# EAGLE schematic WSN_Gateway_v3 (EAGLE 8.2.2)
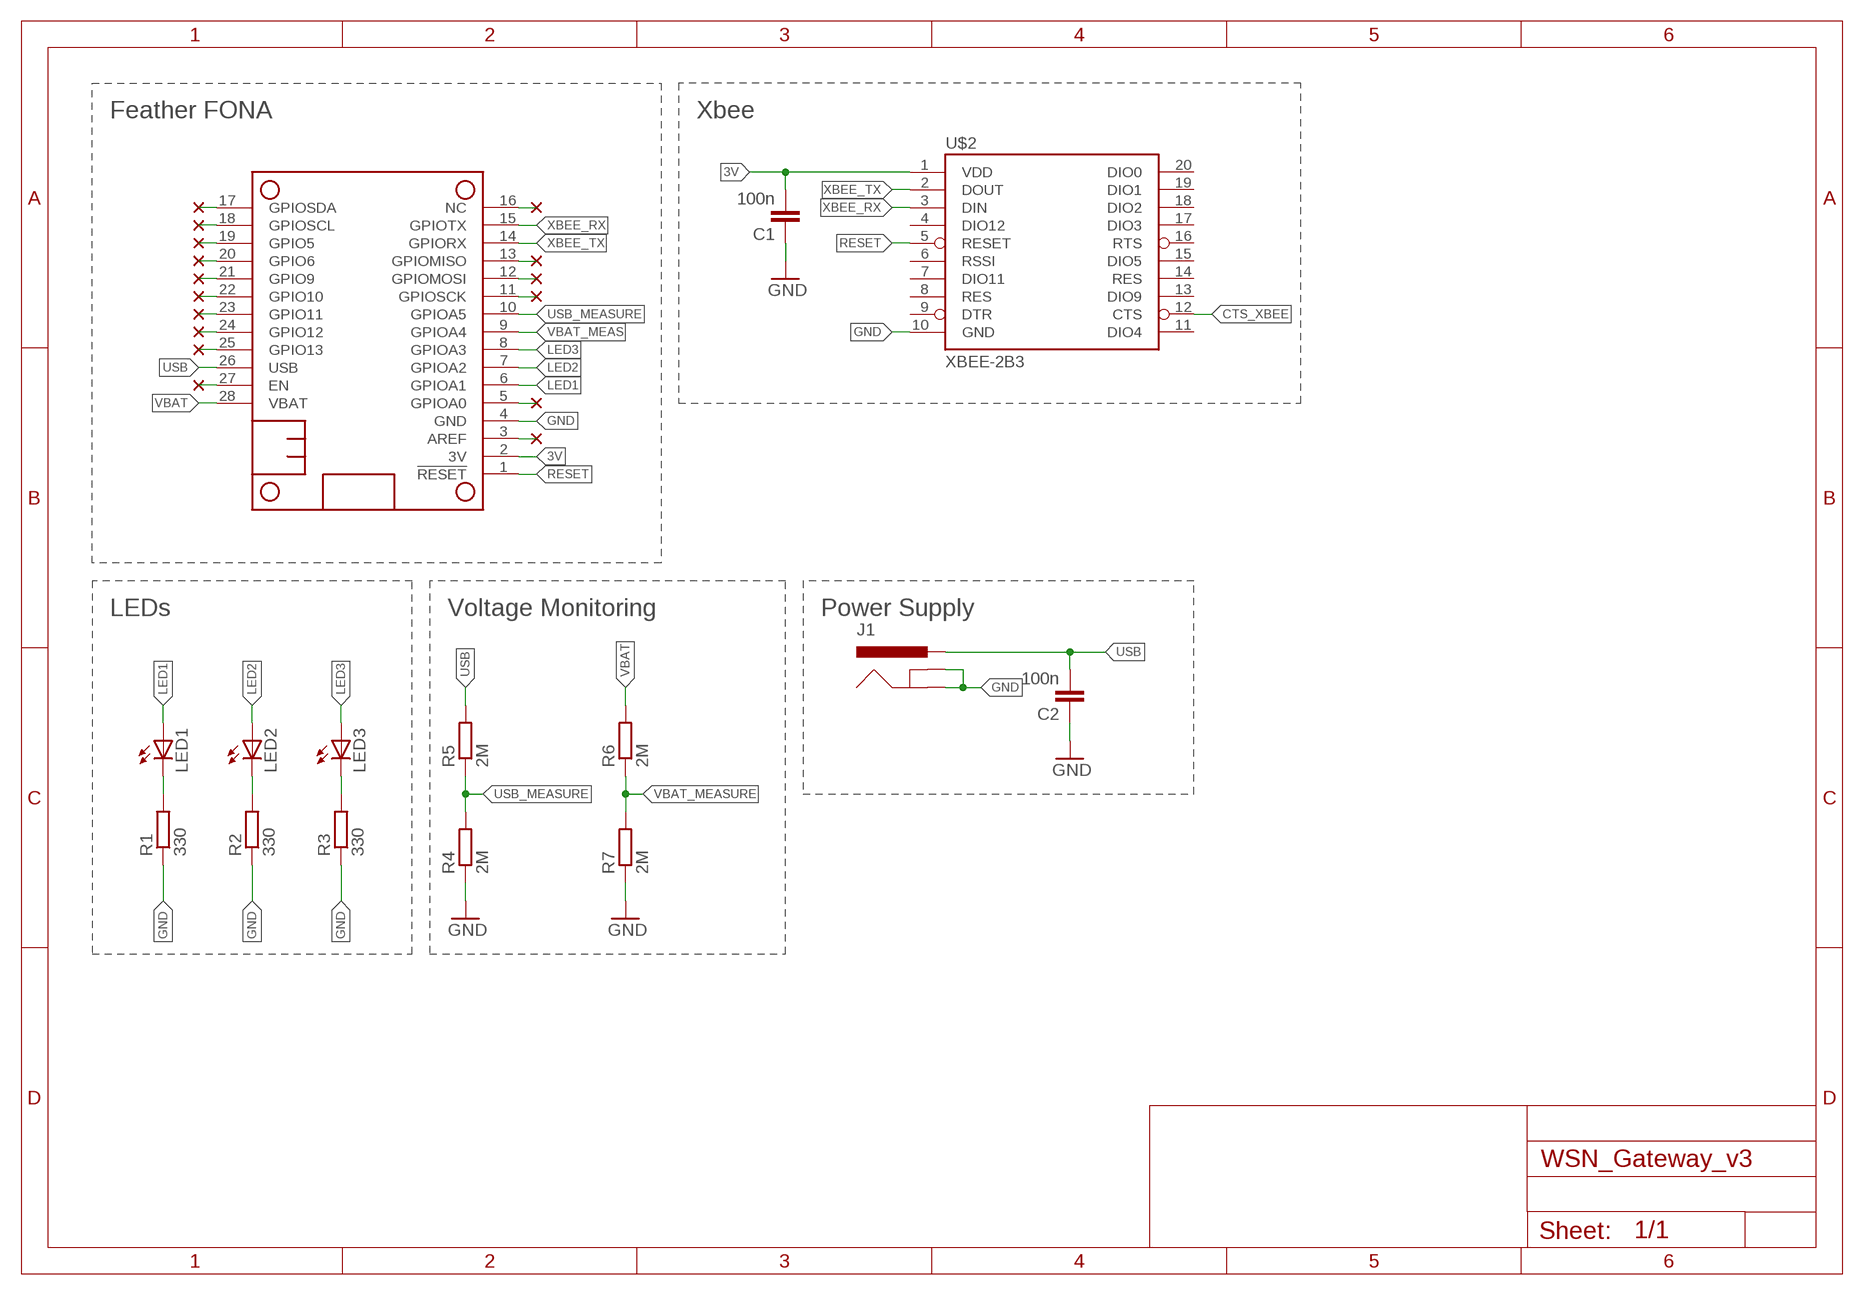
[diagram p0: schematic, sheet 1]

## Parts
C1  100n  C  [C0805]
C2  100n  C  [C0805]
J1  5.5x2.1mm Barrel  POWER_JACKSMD  [POWER_JACK_SMD]
LED1  LEDCHIPLED_0805  [CHIPLED_0805]
LED2  LEDCHIPLED_0805  [CHIPLED_0805]
LED3  LEDCHIPLED_0805  [CHIPLED_0805]
MS1  FEATHERWING_NODIM_NOHOLES  [FEATHERWING_DIM_2]
R1  330  R-EU_R0805  [R0805]
R2  330  R-EU_R0805  [R0805]
R3  330  R-EU_R0805  [R0805]
R4  2M  R-EU_R0805  [R0805]
R5  2M  R-EU_R0805  [R0805]
R6  2M  R-EU_R0805  [R0805]
R7  2M  R-EU_R0805  [R0805]
U$2  XBEE-2B3  [XBEE-SMD]

## Nets
3V: C1.2 MS1.2(3V) U$2.1(VDD)
CTS_XBEE: U$2.12(CTS)
GND: C1.1 C2.1 J1.GND(GNDBREAK) J1.P$4(GND) MS1.4(GND) R1.1 R2.1 R3.1 R4.1 R7.1 U$2.10(GND)
LED1: LED1.A MS1.6(GPIOA1)
LED2: LED2.A MS1.7(GPIOA2)
LED3: LED3.A MS1.8(GPIOA3)
N$1: LED1.C R1.2
N$2: LED2.C R2.2
N$3: LED3.C R3.2
N$4: MS1.25(GPIO13)
N$5: MS1.24(GPIO12)
N$6: MS1.23(GPIO11)
N$7: MS1.22(GPIO10)
N$8: MS1.21(GPIO9)
N$9: MS1.20(GPIO6)
N$10: MS1.19(GPIO5)
N$11: MS1.18(GPIOSCL)
N$12: MS1.17(GPIOSDA)
N$13: MS1.16(NC)
N$14: MS1.13(GPIOMISO)
N$15: MS1.12(GPIOMOSI)
N$16: MS1.11(GPIOSCK)
N$17: MS1.5(GPIOA0)
N$18: MS1.3(AREF)
N$20: MS1.27(EN)
RESET: MS1.1(!RESET) U$2.5(RESET)
USB: C2.2 J1.VIN0(PWR) J1.VIN1(PWR) MS1.26(USB) R5.2
USB_MEASURE: MS1.10(GPIOA5) R4.2 R5.1
VBAT: MS1.28(VBAT) R6.2
VBAT_MEAS: MS1.9(GPIOA4)
VBAT_MEASURE: R6.1 R7.2
XBEE_RX: MS1.15(GPIOTX) U$2.3(DIN)
XBEE_TX: MS1.14(GPIORX) U$2.2(DOUT)
Unconnected: U$2.4(DIO12) U$2.6(RSSI) U$2.7(DIO11) U$2.8(RES) U$2.9(DTR) U$2.11(DIO4) U$2.13(DIO9) U$2.14(RES) U$2.15(DIO5) U$2.16(RTS) U$2.17(DIO3) U$2.18(DIO2) U$2.19(DIO1) U$2.20(DIO0)

## Notes on the sheet
- Feather FONA | Xbee
- LEDs | Voltage Monitoring | Power Supply

## Library data of the parts
C1 C2 = wsn:C: CAPACITOR, European symbol; SPICEMODEL: NONE; SPICEPREFIX: C
J1 = wsn:POWER_JACK: Power Jack This is the standard 5.5mm barrel jack for power. The PTH is the most common, proven, reliable, footprint. The Slot footprint only works if the mill layer is transmitted to the PCB fab house so be warned. Mating wall wart : TOL-00298 (and others); PROD_ID: CONN-08106; SF_ID: PRT-12748
LED1-LED3 = adafruit:LED: LED OSRAM: - CHIPLED LG R971, LG N971, LY N971, LG Q971, LY Q971, LO R971, LY R971 LH N974, LH R974 LS Q976, LO Q976, LY Q976 LO Q996 - Hyper CHIPLED LW Q18S LB Q993, LB Q99A, LB R99A - SideLED LS A670, LO A670, LY A670, LG A670, LP A670 LB A673, LV A673, LT A673, LW A673 LH A674 LY A675 LS A676, LA A676, LO A676, LY A676, LW A676 LS A679, LY A679, LG A679 - Hyper Micro SIDELED® LS Y876, LA Y876, LO Y876, LY Y876 LT Y87S - SmartLED LW L88C, LW L88S LB L89C, LB L89S, LG L890 LS L89K, LO L89K, LY L89K LS L896, LA L896, LO L896, LY L896 - TOPLED LS T670, LO T670, LY T670, LG T670, LP T670 LSG T670, LSP T670, LSY T670, LOP T670, LYG T670 LG T671, LOG T671, LSG T671 LB T673, LV T673, LT T673, LW T673 LH T674 LS T676, LA T676, LO T676, LY T676, LB T676, LH T676, LSB T676, LW T676 LB T67C, LV T67C, LT T67C, LS T67K, LO T67K, LY T67K, LW E67C LS E67B, LA E67B, LO E67B, LY E67B, LB E67C, LV E67C, LT E67C LW T67C LS T679, LY T679, LG T679 LS T770, LO T770, LY T770, LG T770, LP T770 LB T773, LV T773, LT T773, LW T773 LH T774 LS E675, LA E675, LY E675, LS T675 LS T776, LA T776, LO T776, LY T776, LB T776 LHGB T686 LT T68C, LB T68C - Hyper Mini TOPLED® LB M676 - Mini TOPLED Santana® LG M470 LS M47K, LO M47K, LY M47K Source: http://www.osram.convergy.de/
MS1 = adafruit:FEATHERWING
R1-R7 = rcl:R-EU_: RESISTOR, European symbol
U$2 = SparkFun-RF:XBEE-2: Xbee module footprints SMT header is CONN-09042.; PROD_ID: CONN-09042